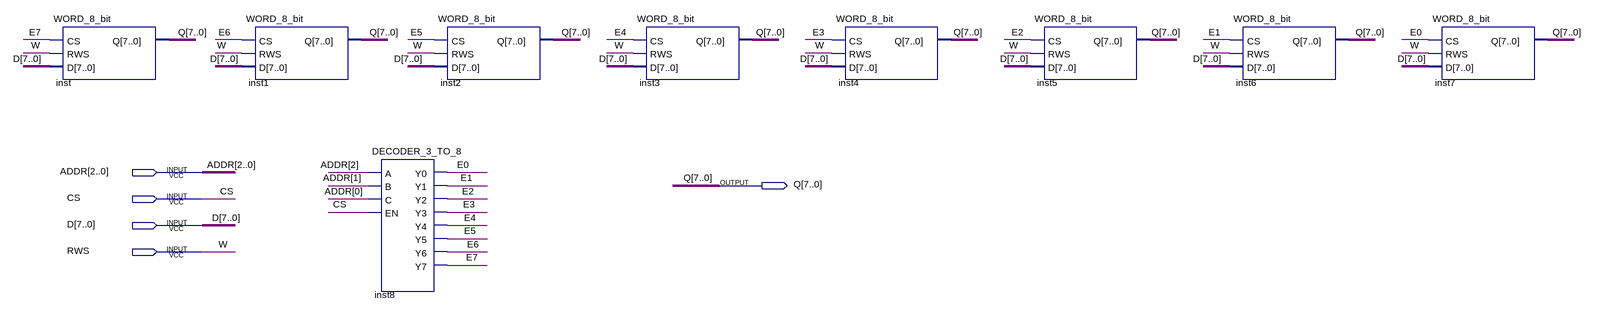
[diagram p0: schematic sheet]
// Quartus schematic RAM8X8.bdf as structural Verilog: 9 symbols, 5 pins
module RAM8X8 (
  input  [2:0] ADDR,
  input  CS,
  input  [7:0] D,
  input  RWS,
  output [7:0] Q
);

  wire E0, E1, E2, E3, E4, E5, E6, E7;

  WORD_8_bit inst (.CS(E7), .RWS(RWS), .D(D), .Q(Q));
  WORD_8_bit inst1 (.CS(E6), .RWS(RWS), .D(D), .Q(Q));
  DECODER_3_TO_8 inst8 (
    .A(ADDR[2]), .B(ADDR[1]), .C(ADDR[0]), .EN(CS), .Y0(E0), .Y1(E1), .Y2(E2), .Y3(E3), .Y4(E4), .Y5(E5),
    .Y6(E6), .Y7(E7));
  WORD_8_bit inst2 (.CS(E5), .RWS(RWS), .D(D), .Q(Q));
  WORD_8_bit inst3 (.CS(E4), .RWS(RWS), .D(D), .Q(Q));
  WORD_8_bit inst4 (.CS(E3), .RWS(RWS), .D(D), .Q(Q));
  WORD_8_bit inst5 (.CS(E2), .RWS(RWS), .D(D), .Q(Q));
  WORD_8_bit inst6 (.CS(E1), .RWS(RWS), .D(D), .Q(Q));
  WORD_8_bit inst7 (.CS(E0), .RWS(RWS), .D(D), .Q(Q));

  // Other names for the same wires on the sheet: W = RWS
endmodule
